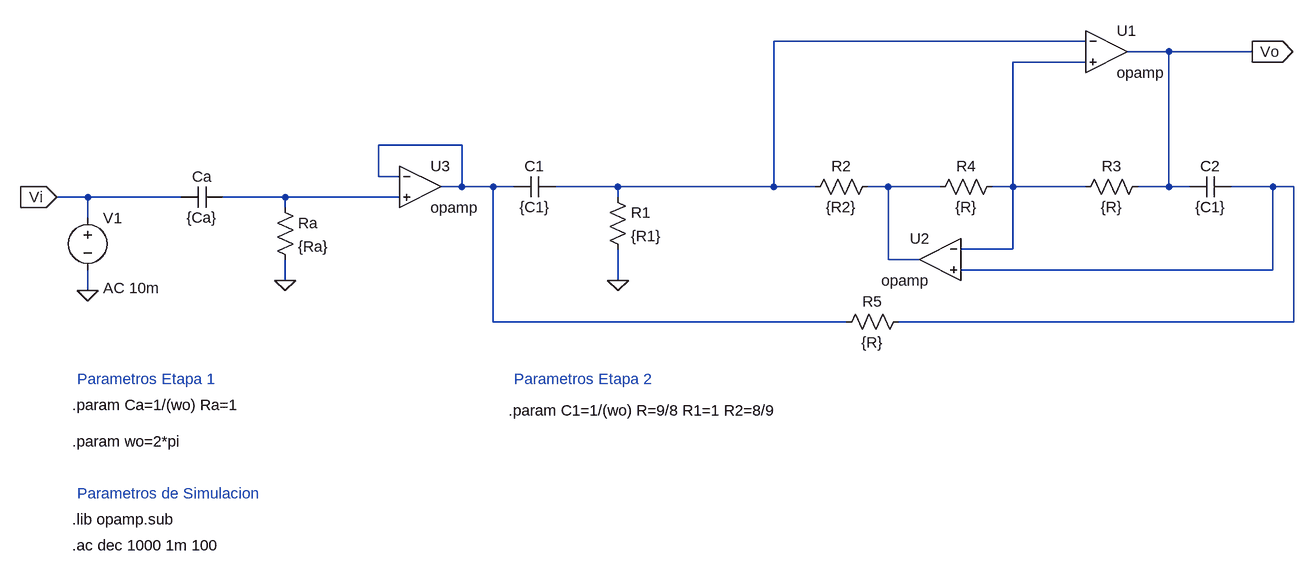
[diagram p0: schematic TS5_Normalizado.asc]
TS5_Normalizado.asc, the LTspice schematic file:
Version 4
SHEET 1 880 680
WIRE 400 -288 -80 -288
WIRE 528 -272 464 -272
WIRE 656 -272 528 -272
WIRE 400 -256 288 -256
WIRE -560 -128 -688 -128
WIRE -688 -80 -688 -128
WIRE -656 -80 -688 -80
WIRE -560 -64 -560 -128
WIRE -560 -64 -592 -64
WIRE -512 -64 -560 -64
WIRE -480 -64 -512 -64
WIRE -320 -64 -416 -64
WIRE -80 -64 -80 -288
WIRE -80 -64 -320 -64
WIRE -16 -64 -80 -64
WIRE 96 -64 64 -64
WIRE 176 -64 96 -64
WIRE 288 -64 288 -256
WIRE 288 -64 256 -64
WIRE 400 -64 288 -64
WIRE 528 -64 528 -272
WIRE 528 -64 480 -64
WIRE 560 -64 528 -64
WIRE 688 -64 624 -64
WIRE 720 -64 688 -64
WIRE -1136 -48 -1184 -48
WIRE -992 -48 -1136 -48
WIRE -832 -48 -928 -48
WIRE -656 -48 -832 -48
WIRE -320 -48 -320 -64
WIRE -832 -32 -832 -48
WIRE -1136 -16 -1136 -48
WIRE 288 32 288 -64
WIRE 288 32 208 32
WIRE 96 48 96 -64
WIRE 144 48 96 48
WIRE 688 64 688 -64
WIRE 688 64 208 64
WIRE -832 80 -832 48
WIRE -320 80 -320 32
WIRE -1136 96 -1136 64
WIRE -512 144 -512 -64
WIRE 32 144 -512 144
WIRE 720 144 720 -64
WIRE 720 144 112 144
FLAG -832 80 0
FLAG -1136 96 0
FLAG -320 80 0
FLAG 656 -272 Vo
IOPIN 656 -272 Out
FLAG -1184 -48 Vi
IOPIN -1184 -48 In
SYMBOL OpAmps\\opamp 432 -336 R0
SYMATTR InstName U1
SYMBOL OpAmps\\opamp 176 -16 M0
SYMATTR InstName U2
SYMBOL cap -928 -64 R90
WINDOW 0 0 32 VBottom 2
WINDOW 3 32 32 VTop 2
SYMATTR InstName Ca
SYMATTR Value {Ca}
SYMBOL res -848 -48 R0
SYMATTR InstName Ra
SYMATTR Value {Ra}
SYMBOL voltage -1136 -32 R0
WINDOW 123 24 124 Left 2
WINDOW 39 0 0 Left 0
SYMATTR Value2 AC 10m
SYMATTR InstName V1
SYMATTR Value ""
SYMBOL OpAmps\\opamp -624 -128 R0
SYMATTR InstName U3
SYMBOL cap -416 -80 R90
WINDOW 0 0 32 VBottom 2
WINDOW 3 32 32 VTop 2
SYMATTR InstName C1
SYMATTR Value {C1}
SYMBOL res -336 -64 R0
SYMATTR InstName R1
SYMATTR Value {R1}
SYMBOL res 80 -80 R90
WINDOW 0 0 56 VBottom 2
WINDOW 3 32 56 VTop 2
SYMATTR InstName R2
SYMATTR Value {R2}
SYMBOL res 272 -80 R90
WINDOW 0 0 56 VBottom 2
WINDOW 3 32 56 VTop 2
SYMATTR InstName R4
SYMATTR Value {R}
SYMBOL res 496 -80 R90
WINDOW 0 0 56 VBottom 2
WINDOW 3 32 56 VTop 2
SYMATTR InstName R3
SYMATTR Value {R}
SYMBOL cap 624 -80 R90
WINDOW 0 0 32 VBottom 2
WINDOW 3 32 32 VTop 2
SYMATTR InstName C2
SYMATTR Value {C1}
SYMBOL res 128 128 R90
WINDOW 0 0 56 VBottom 2
WINDOW 3 32 56 VTop 2
SYMATTR InstName R5
SYMATTR Value {R}
TEXT -1160 448 Left 2 !.lib opamp.sub
TEXT -1160 272 Left 2 !.param Ca=1/(wo) Ra=1
TEXT -488 280 Left 2 !.param C1=1/(wo) R=9/8 R1=1 R2=8/9
TEXT -1160 328 Left 2 !.param wo=2*pi
TEXT -1160 488 Left 2 !.ac dec 1000 1m 100
TEXT -1152 232 Left 2 ;Parametros Etapa 1
TEXT -480 232 Left 2 ;Parametros Etapa 2
TEXT -1152 408 Left 2 ;Parametros de Simulacion

The netlist it stands for:
* TS5_Normalizado.asc
XU1 N001 N002 Vo opamp Aol=100K GBW=10Meg  ; pins invin noninvin out
XU2 N002 N005 N004 opamp Aol=100K GBW=10Meg  ; pins invin noninvin out
Ca N006 Vi {Ca}
Ra N006 0 {Ra}
V1 Vi 0 AC 10m
XU3 N003 N006 N003 opamp Aol=100K GBW=10Meg  ; pins invin noninvin out
C1 N001 N003 {C1}
R1 N001 0 {R1}
R2 N004 N001 {R2}
R4 N002 N004 {R}
R3 Vo N002 {R}
C2 N005 Vo {C1}
R5 N005 N003 {R}
.lib opamp.sub
.param Ca=1/(wo) Ra=1
.param C1=1/(wo) R=9/8 R1=1 R2=8/9
.param wo=2*pi
.ac dec 1000 1m 100
* Parametros Etapa 1
* Parametros Etapa 2
* Parametros de Simulacion
.backanno
.end

* Results of the author's LTspice run, read from the files saved beside the schematic
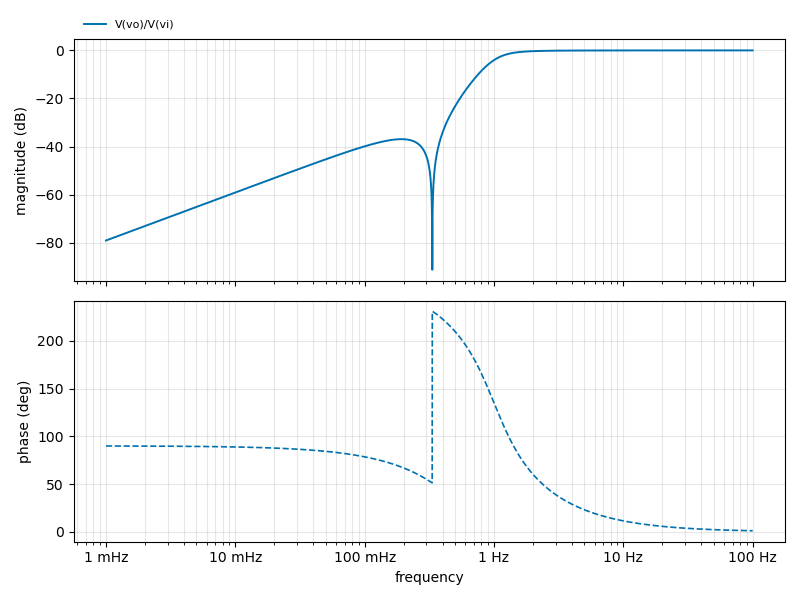
[diagram p1: AC Analysis of TS5_Normalizado.asc, plotted from the saved traces]
* AC Analysis, 1 run:
*   V(vo)/V(vi): -79.09 dB at 1 mHz, -0.00 dB at 100 Hz, peak -0.00 dB at 100 Hz, 3 dB below the peak at 1.078 Hz